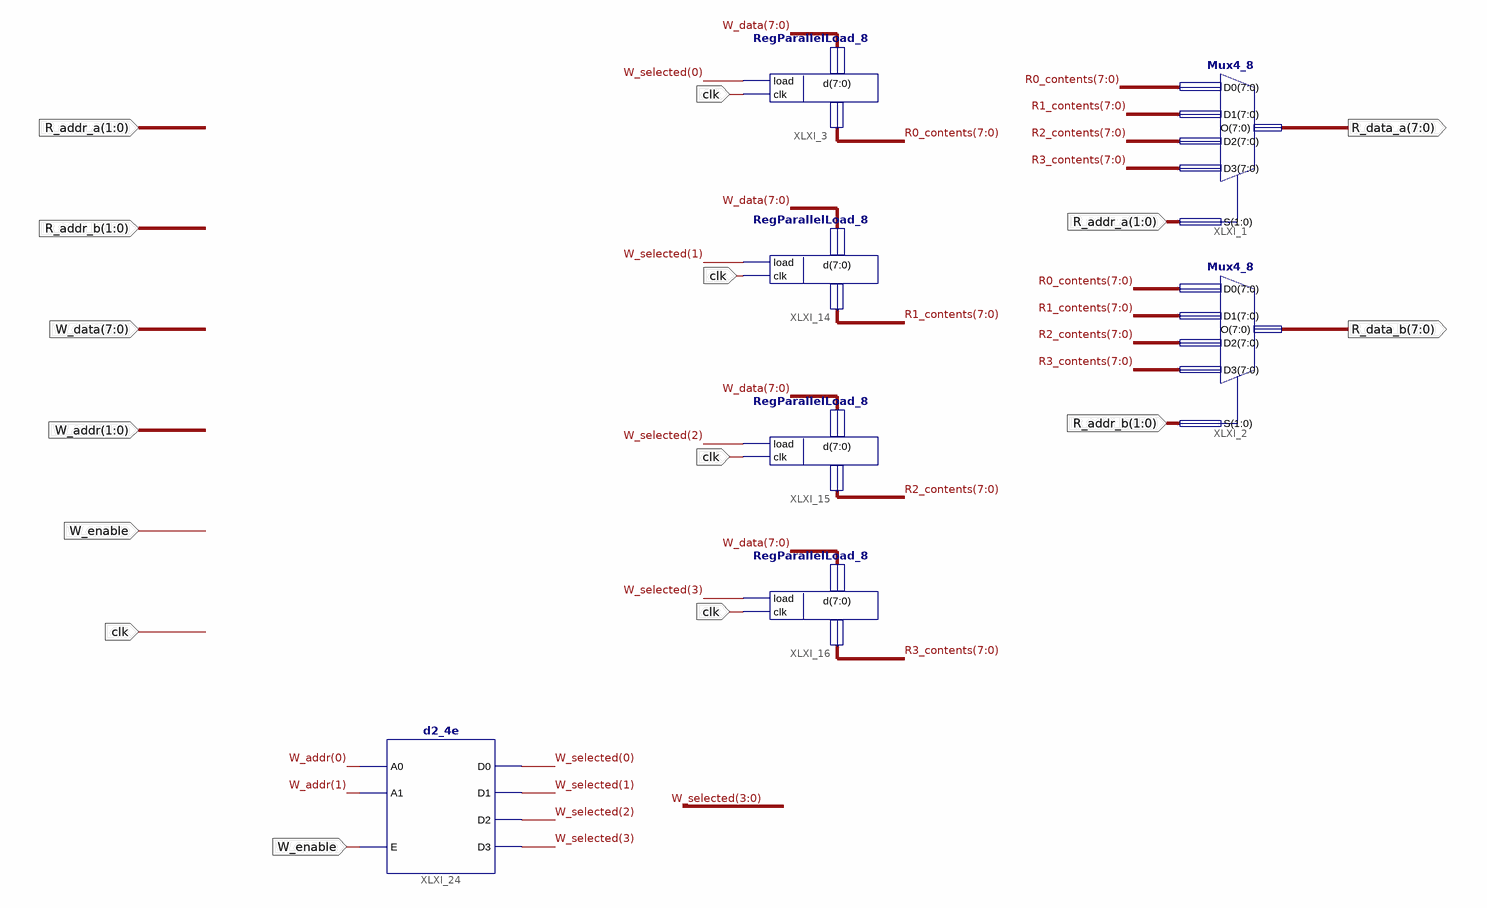
[diagram p0: schematic sheet 1]
// Xilinx ISE schematic RegFile.sch (spartan3e) as structural Verilog: 7 symbols, 8 ports
module RegFile (
  input  [1:0] R_addr_a,
  input  [1:0] R_addr_b,
  input  [7:0] W_data,
  input  [1:0] W_addr,
  input  W_enable,
  input  clk,
  output [7:0] R_data_a,
  output [7:0] R_data_b
);

  wire [3:0] W_selected;
  wire [7:0] R0_contents, R1_contents, R2_contents, R3_contents;

  Mux4_8 XLXI_1 (.D0(R0_contents), .D1(R1_contents), .D2(R2_contents), .D3(R3_contents), .S(R_addr_a), .O(R_data_a));
  Mux4_8 XLXI_2 (.D0(R0_contents), .D1(R1_contents), .D2(R2_contents), .D3(R3_contents), .S(R_addr_b), .O(R_data_b));
  RegParallelLoad_8 XLXI_3 (.clk(clk), .q(R0_contents), .load(W_selected[0]), .d(W_data));
  RegParallelLoad_8 XLXI_14 (.clk(clk), .q(R1_contents), .load(W_selected[1]), .d(W_data));
  RegParallelLoad_8 XLXI_15 (.clk(clk), .q(R2_contents), .load(W_selected[2]), .d(W_data));
  RegParallelLoad_8 XLXI_16 (.clk(clk), .q(R3_contents), .load(W_selected[3]), .d(W_data));
  d2_4e XLXI_24 (
    .A0(W_addr[0]), .A1(W_addr[1]), .E(W_enable), .D0(W_selected[0]), .D1(W_selected[1]), .D2(W_selected[2]),
    .D3(W_selected[3]));
endmodule
